# Altium schematic sheet FilterBoard.Schematic.SchDoc
size B
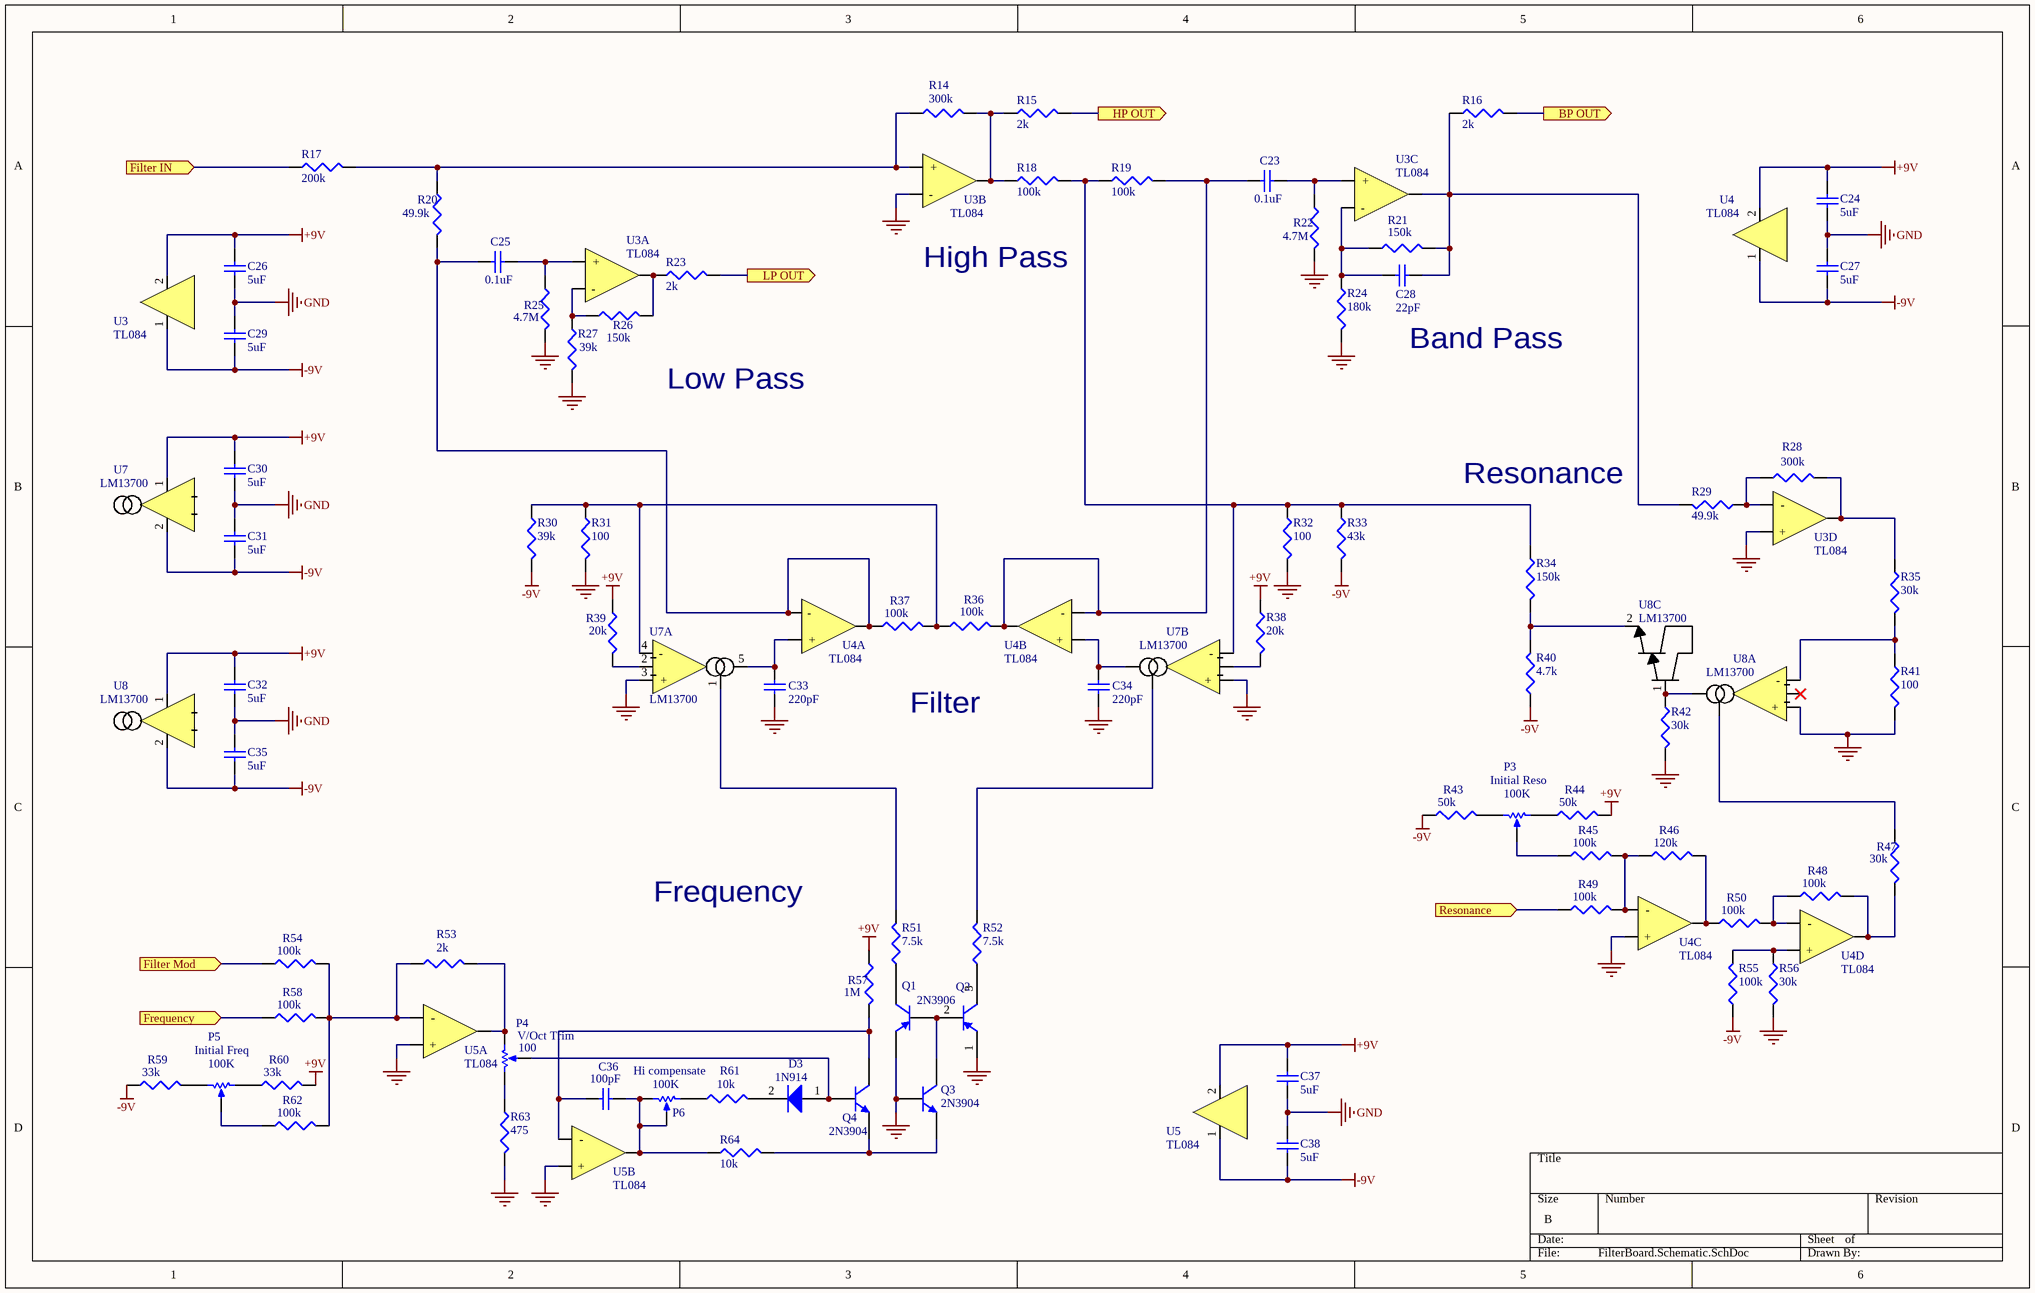
[diagram p0: FilterBoard.Schematic.SchDoc]

## Parts
C23  0.1uF  [CAPC1608N - cap]
C24  5uF  [CAPC1608N - cap]
C25  0.1uF  [CAPC1608N - cap]
C26  5uF  [CAPC1608N - cap]
C27  5uF  [CAPC1608N - cap]
C28  22pF  [CAPC1608N - cap]
C29  5uF  [CAPC1608N - cap]
C30  5uF  [CAPC1608N - cap]
C31  5uF  [CAPC1608N - cap]
C32  5uF  [CAPC1608N - cap]
C33  220pF  [CAPC1608N - cap]
C34  220pF  [CAPC1608N - cap]
C35  5uF  [CAPC1608N - cap]
C36  100pF  [CAPC1608N - cap]
C37  5uF  [CAPC1608N - cap]
C38  5uF  [CAPC1608N - cap]
D3  1N914  [1N914]
P3  Initial Reso  value 100K  [BOURNS Trim pot]
P4  V/Oct Trim  value 100  [BOURNS Trim pot]
P5  Initial Freq  value 100K  [BOURNS Trim pot]
P6  Hi compensate  value 100K  [BOURNS Trim pot]
Q1  2N3906  [2N3906]
Q2  2N3906  [2N3906]  (value not drawn)
Q3  2N3904  [2N3906]
Q4  2N3904  [2N3906]
R14  300k  [CAPC1608N]
R15  2k  [CAPC1608N]
R16  2k  [CAPC1608N]
R17  200k  [CAPC1608N]
R18  100k  [CAPC1608N]
R19  100k  [CAPC1608N]
R20  49.9k  [CAPC1608N]
R21  150k  [CAPC1608N]
R22  4.7M  [CAPC1608N]
R23  2k  [CAPC1608N]
R24  180k  [CAPC1608N]
R25  4.7M  [CAPC1608N]
R26  150k  [CAPC1608N]
R27  39k  [CAPC1608N]
R28  300k  [CAPC1608N]
R29  49.9k  [CAPC1608N]
R30  39k  [CAPC1608N]
R31  100  [CAPC1608N]
R32  100  [CAPC1608N]
R33  43k  [CAPC1608N]
R34  150k  [CAPC1608N]
R35  30k  [CAPC1608N]
R36  100k  [CAPC1608N]
R37  100k  [CAPC1608N]
R38  20k  [CAPC1608N]
R39  20k  [CAPC1608N]
R40  4.7k  [CAPC1608N]
R41  100  [CAPC1608N]
R42  30k  [CAPC1608N]
R43  50k  [CAPC1608N]
R44  50k  [CAPC1608N]
R45  100k  [CAPC1608N]
R46  120k  [CAPC1608N]
R47  30k  [CAPC1608N]
R48  100k  [CAPC1608N]
R49  100k  [CAPC1608N]
R50  100k  [CAPC1608N]
R51  7.5k  [CAPC1608N]
R52  7.5k  [CAPC1608N]
R53  2k  [CAPC1608N]
R54  100k  [CAPC1608N]
R55  100k  [CAPC1608N]
R56  30k  [CAPC1608N]
R57  1M  [CAPC1608N]
R58  100k  [CAPC1608N]
R59  33k  [CAPC1608N]
R60  33k  [CAPC1608N]
R61  10k  [CAPC1608N]
R62  100k  [CAPC1608N]
R63  475  [CAPC1608N]
R64  10k  [CAPC1608N]
U3  TL084  [TL084 - Alim]
U3A  TL084  [TL084 - 3pads]
U3B  TL084  [TL084 - 3pads]
U3C  TL084  [TL084 - 3pads]
U3D  TL084  [TL084 - 3pads]
U4  TL084  [TL084 - Alim]
U4A  TL084  [TL084 - 3pads]
U4B  TL084  [TL084 - 3pads]
U4C  TL084  [TL084 - 3pads]
U4D  TL084  [TL084 - 3pads]
U5  TL084  [TL084 - Alim]
U5A  TL084  [TL084 - 3pads]
U5B  TL084  [TL084 - 3pads]
U7  LM13700  [LM13700 - Alim]
U7A  LM13700  [LM13700 - A]
U7B  LM13700  [LM13700 - B]
U8  LM13700  [LM13700 - Alim]
U8A  LM13700  [LM13700 - A]
U8C  LM13700  [LM13700 - C]

## Ports
BP OUT (out), Filter IN (in), Filter Mod (in), Frequency (in), HP OUT (out), LP OUT (out), Resonance (in)

## Nets
+9V: C24.1 C26.1 C30.1 C32.1 C37.1 R38.1 R39.1 R44.2 R57.1 R60.2 U3.2(VCC-) U4.2(VCC-) U5.2(VCC-) U7.1(VCC-) U8.1(VCC-)
-9V: C27.2 C29.2 C31.2 C35.2 C38.2 R30.2 R33.2 R40.1 R43.1 R55.1 R59.1 U3.1(VCC+) U4.1(VCC+) U5.1(VCC+) U7.2(VCC-) U8.2(VCC-)
GND: C24.2 C26.2 C27.1 C29.1 C30.2 C31.1 C32.2 C33.1 C34.1 C35.1 C37.2 C38.1 Q1.1(E) Q2.1(E) Q3.2(B) R22.2 R24.2 R25.2 R27.2 R31.2 R32.2 R41.2 R42.2 R56.2 R63.2 U3B.2(-) U3D.3(+) U4C.3(+) U5A.3(+) U5B.3(+) U7A.3(+) U7B.3(+) U8A.3(+)
BP OUT: R16.2 ; port BP OUT
Filter IN: R17.1 ; port Filter IN
Filter Mod: R54.1 ; port Filter Mod
Frequency: R58.1 ; port Frequency
HP OUT: R15.2 ; port HP OUT
LP OUT: R23.2 ; port LP OUT
Resonance: R49.1 ; port Resonance
NetC23_1: C23.1 R19.2 R36.2 U4B.1(OUT) U4B.2(-)
NetC23_2: C23.2 R22.1 U3C.3(+)
NetC25_1: C25.1 R20.2 R37.1 U4A.1(OUT) U4A.2(-)
NetC25_2: C25.2 R25.1 U3A.3(+)
NetC28_1: C28.1 R21.1 R24.1 U3C.2(-)
NetC28_2: C28.2 R16.1 R21.2 R29.2 U3C.1(OUT)
NetC33_2: C33.2 U4A.3(+) U7A.5(OUT)
NetC34_2: C34.2 U4B.3(+) U7B.5(OUT)
NetC36_1: C36.1 Q4.3(C) R57.2 U5B.2(-)
NetC36_2: C36.2 P6.2(BOT) P6.3(TAP) R64.1 U5B.1(OUT)
NetD3_1: D3.1(A) P4.3(TAP) Q4.2(B)
NetD3_2: D3.2(K) R61.2
NetP3_1: P3.1(TOP) R44.1
NetP3_2: P3.2(BOT) R43.2
NetP3_3: P3.3(TAP) R45.1
NetP4_1: P4.1(TOP) R53.2 U5A.1(OUT)
NetP4_2: P4.2(BOT) R63.1
NetP5_1: P5.1(TOP) R60.1
NetP5_2: P5.2(BOT) R59.2
NetP5_3: P5.3(TAP) R62.1
NetP6_1: P6.1(TOP) R61.1
NetQ1_2: Q1.2(B) Q2.2(B) Q3.3(C)
NetQ1_3: Q1.3(C) R51.1
NetQ2_3: Q2.3(C) R52.1
NetQ3_1: Q3.1(E) Q4.1(E) R64.2
NetR14_1: R14.1 R17.2 R20.1 U3B.3(+)
NetR14_2: R14.2 R15.1 R18.1 U3B.1(OUT)
NetR18_2: R18.2 R19.1 R32.1 R33.1 R34.1 U7B.4(-)
NetR23_1: R23.1 R26.2 U3A.1(OUT)
NetR26_1: R26.1 R27.1 U3A.2(-)
NetR28_1: R28.1 R29.1 U3D.2(-)
NetR28_2: R28.2 R35.1 U3D.1(OUT)
NetR30_1: R30.1 R31.1 R36.1 R37.2 U7A.4(-)
NetR34_2: R34.2 R40.2 U8C.2(V+)
NetR35_2: R35.2 R41.1 U8A.4(-)
NetR38_2: R38.2 U7B.2
NetR39_2: R39.2 U7A.2
NetR42_1: R42.1 U8A.5(OUT) U8C.1(BIN)
NetR45_2: R45.2 R46.1 R49.2 U4C.2(-)
NetR46_2: R46.2 R50.1 U4C.1(OUT)
NetR47_1: R47.1 U8A.1(BIAS)
NetR47_2: R47.2 R48.2 U4D.1(OUT)
NetR48_1: R48.1 R50.2 U4D.2(-)
NetR51_2: R51.2 U7A.1(BIAS)
NetR52_2: R52.2 U7B.1(BIAS)
NetR53_1: R53.1 R54.2 R58.2 R62.2 U5A.2(-)
NetR55_2: R55.2 R56.1 U4D.3(+)

Not connected (* = marked no-connect by the designer): U8A 2*

## Notes on the sheet
- High Pass
- Band Pass
- Low Pass
- Resonance
- Filter
- Frequency

## Library data of the parts
C23 C25 = Cap Semi: Capacitor (Semiconductor SIM Model); Value: 0.1u; Published: 8-Jun-2000; LatestRevisionDate: 29-May-2009; LatestRevisionNote: IPC-7351 Footprint Added.; PackageReference: C1206; Publisher: Altium Limited; PackageDescription: Chip Capacitor
C24 C26 C27 C29-C32 C35 C37 C38 = Cap Semi: Capacitor (Semiconductor SIM Model); Value: 4.7u; Published: 8-Jun-2000; LatestRevisionDate: 29-May-2009; LatestRevisionNote: IPC-7351 Footprint Added.; PackageReference: C1206; Publisher: Altium Limited; PackageDescription: Chip Capacitor
C28 = Cap Semi: Capacitor (Semiconductor SIM Model); Value: 22p; Published: 8-Jun-2000; LatestRevisionDate: 29-May-2009; LatestRevisionNote: IPC-7351 Footprint Added.; PackageReference: C1206; Publisher: Altium Limited; PackageDescription: Chip Capacitor
C33 C34 = Cap Semi: Capacitor (Semiconductor SIM Model); Value: 220p; Published: 8-Jun-2000; LatestRevisionDate: 29-May-2009; LatestRevisionNote: IPC-7351 Footprint Added.; PackageReference: C1206; Publisher: Altium Limited; PackageDescription: Chip Capacitor
C36 = Cap Semi: Capacitor (Semiconductor SIM Model); Value: 100p; Published: 8-Jun-2000; LatestRevisionDate: 29-May-2009; LatestRevisionNote: IPC-7351 Footprint Added.; PackageReference: C1206; Publisher: Altium Limited; PackageDescription: Chip Capacitor
D3 = Diode 1N4001: 1 Amp General Purpose Rectifier; Ref_Fabricant: 1N914BWT; Fabricant: Fairchild Semiconductor; Published: 8-Jun-2000; LatestRevisionDate: 17-Jul-2002; LatestRevisionNote: Re-released for DXP Platform.; DatasheetVersion: 1998; PackageVersion: Aug-1999; PackageReference: DO-41; Publisher: Altium Limited; PackageDescription: Diode, Axial; Body 5.2 x 2.7 mm (LxDia. max), Lead Dia. 0.86 mm (max); Code_JEDEC: DO-204-AL; ComponentLink1Description: Manufacturer Link; ComponentLink1URL: http://www.fairchildsemi.com/; ComponentLink2Description: Datasheet; ComponentLink2URL: http://www.fairchildsemi.com/ds/1N%2F1N4001.pdf; Ref_Farnell: 2453752; Datasheet: http://www.farnell.com/datasheets/1781082.pdf
P3-P6 = RPot: Potentiometer; Sim Note: Enter the Resistance value and the set point into parameter fields.; Set Position: 0.5; Fabricant: Bourns; Ref_Fabricant: 3362P-1-103LF; Published: 8-Jun-2000; LatestRevisionDate: 17-Jul-2002; LatestRevisionNote: Re-released for DXP Platform.; PackageReference: VR5; Publisher: Altium Limited; PackageDescription: Variable Resistor, Thru-Hole; 3 Leads; Datasheet: http://www.farnell.com/datasheets/2034958.pdf; Ref_Farnell: 9354301
Q1 Q2 = 2N3906: PNP General Purpose Amplifier; Ref_Fabricant: MMBT3906-7-F; Fabricant: Diodes INC.; Published: 8-Jun-2000; LatestRevisionDate: 15-Jan-2003; LatestRevisionNote: PCB Footprint 'BCY-W3/D4.7' replaced; DatasheetVersion: 1997; PackageVersion: Sep-1998; PackageReference: TO-92A; Publisher: Altium Limited; PackageDescription: TO, Flat Index; 3 In-Line, Axial Leads; Body Dia. 4.5mm; Leads 0.51 x 0.48 mm (max); ComponentLink1Description: Manufacturer Link; ComponentLink1URL: http://www.fairchildsemi.com/; ComponentLink2Description: Datasheet; ComponentLink2URL: http://www.fairchildsemi.com/ds/2N%2F2N3906.pdf; Datasheet: http://www.farnell.com/datasheets/1817590.pdf; Ref_Farnell: 1773629
Q3 Q4 = 2N3904: NPN General Purpose Amplifier; Fabricant: Diodes INC.; Ref_Fabricant: MMBT3904-7-F; Published: 8-Jun-2000; LatestRevisionDate: 15-Jan-2003; LatestRevisionNote: PCB Footprint 'BCY-W3/D4.7' replaced; DatasheetVersion: 1997; PackageVersion: Sep-1998; PackageReference: TO-92A; Publisher: Altium Limited; PackageDescription: TO, Flat Index; 3 In-Line, Axial Leads; Body Dia. 4.5mm; Leads 0.51 x 0.48 mm (max); ComponentLink1Description: Manufacturer Link; ComponentLink1URL: http://www.fairchildsemi.com/; ComponentLink2Description: Datasheet; ComponentLink2URL: http://www.fairchildsemi.com/ds/2N%2F2N3904.pdf; Ref_Farnell: 1773602; Datasheet: http://www.farnell.com/datasheets/1915516.pdf
R14-R64 = Res3: Resistor; Published: 8-Jun-2000; LatestRevisionDate: 29-May-2009; LatestRevisionNote: IPC-7351 Footprint Added.; PackageReference: J1-0603; Publisher: Altium Limited; PackageDescription: Chip Resistor
  R14 R28: Value: 300K
  R15 R16 R23 R53: Value: 2K
  R17: Value: 200K
  R18 R19 R36 R37 R45 R48-R50 R54 R55 R58 R62: Value: 100K
  R20 R29: Value: 49.9K
  R21 R26 R34: Value: 150K
  R22 R25: Value: 4.7M
  R24: Value: 180K
  R27 R30: Value: 39K
  R31 R32 R41: Value: 100
  R33: Value: 43K
  R35 R42 R47 R56: Value: 30K
  R38 R39: Value: 20K
  R40: Value: 4.7K
  R43 R44: Value: 50K
  R46: Value: 120K
  R51 R52: Value: 7.5K
  R57: Value: 1M
  R59 R60: Value: 33K
  R61 R64: Value: 10K
  R63: Value: 475
U3-U5 = TL_CLEAN: Ref_Fabricant: TL084BCD; Fabricant: Fairchild Semiconductor; Datasheet: http://www.farnell.com/datasheets/1882473.pdf; Ref_Farnell: 9593438
U3A U3B U3C U3D U4A U4B U4C U4D U5A U5B = TL084: Ref_Fabricant: TL084BCD; Fabricant: Fairchild Semiconductor; Ref_Farnell: 9593438; Datasheet: http://www.farnell.com/datasheets/1882473.pdf
U7A U7B U8A = LM13700_2: Ref_Fabricant: LM13700N/NOPB; Fabricant: Texas Instruments; Datasheet: http://www.farnell.com/datasheets/1851086.pdf; Ref_Farnell: 1468910
U8C = LM13700_1: Fabricant: Texas Instruments; Ref_Fabricant: LM13700N/NOPB; Ref_Farnell: 1468910; Datasheet: http://www.farnell.com/datasheets/1851086.pdf